# Altium schematic sheet steering_engine_interface.SchDoc
size A4
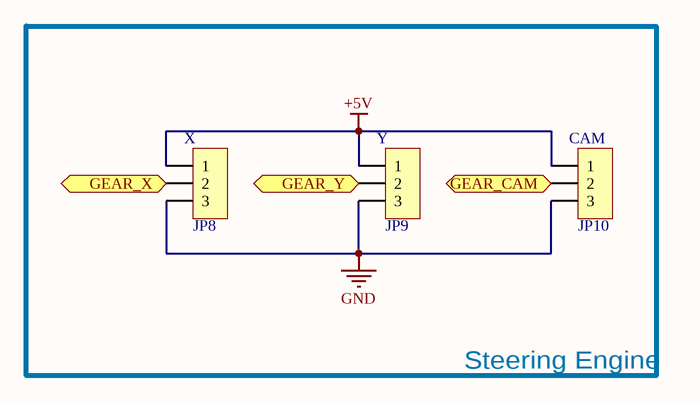
[diagram p0: steering_engine_interface.SchDoc]

## Parts
JP8  X  [HDR2.54-LI-3P]
JP9  Y  [HDR2.54-LI-3P]
JP10  CAM  [HDR2.54-LI-3P]

## Blocks framed on the sheet
Steering Engine: JP8-JP10

## Ports
GEAR_CAM (bidir), GEAR_X (bidir), GEAR_Y (bidir)

## Nets
+5V: JP8.1 JP9.1 JP10.1
GND: JP8.3 JP9.3 JP10.3
GEAR_CAM: JP10.2 ; port GEAR_CAM
GEAR_X: JP8.2 ; port GEAR_X
GEAR_Y: JP9.2 ; port GEAR_Y

## Library data of the parts
JP8-JP10 = Header 3: 3P接插件; 版权归属: 源创客; BOM名称: 3P接插件; 学习资源: www.ooocke.com